# EAGLE design main (EAGLE 6.4)
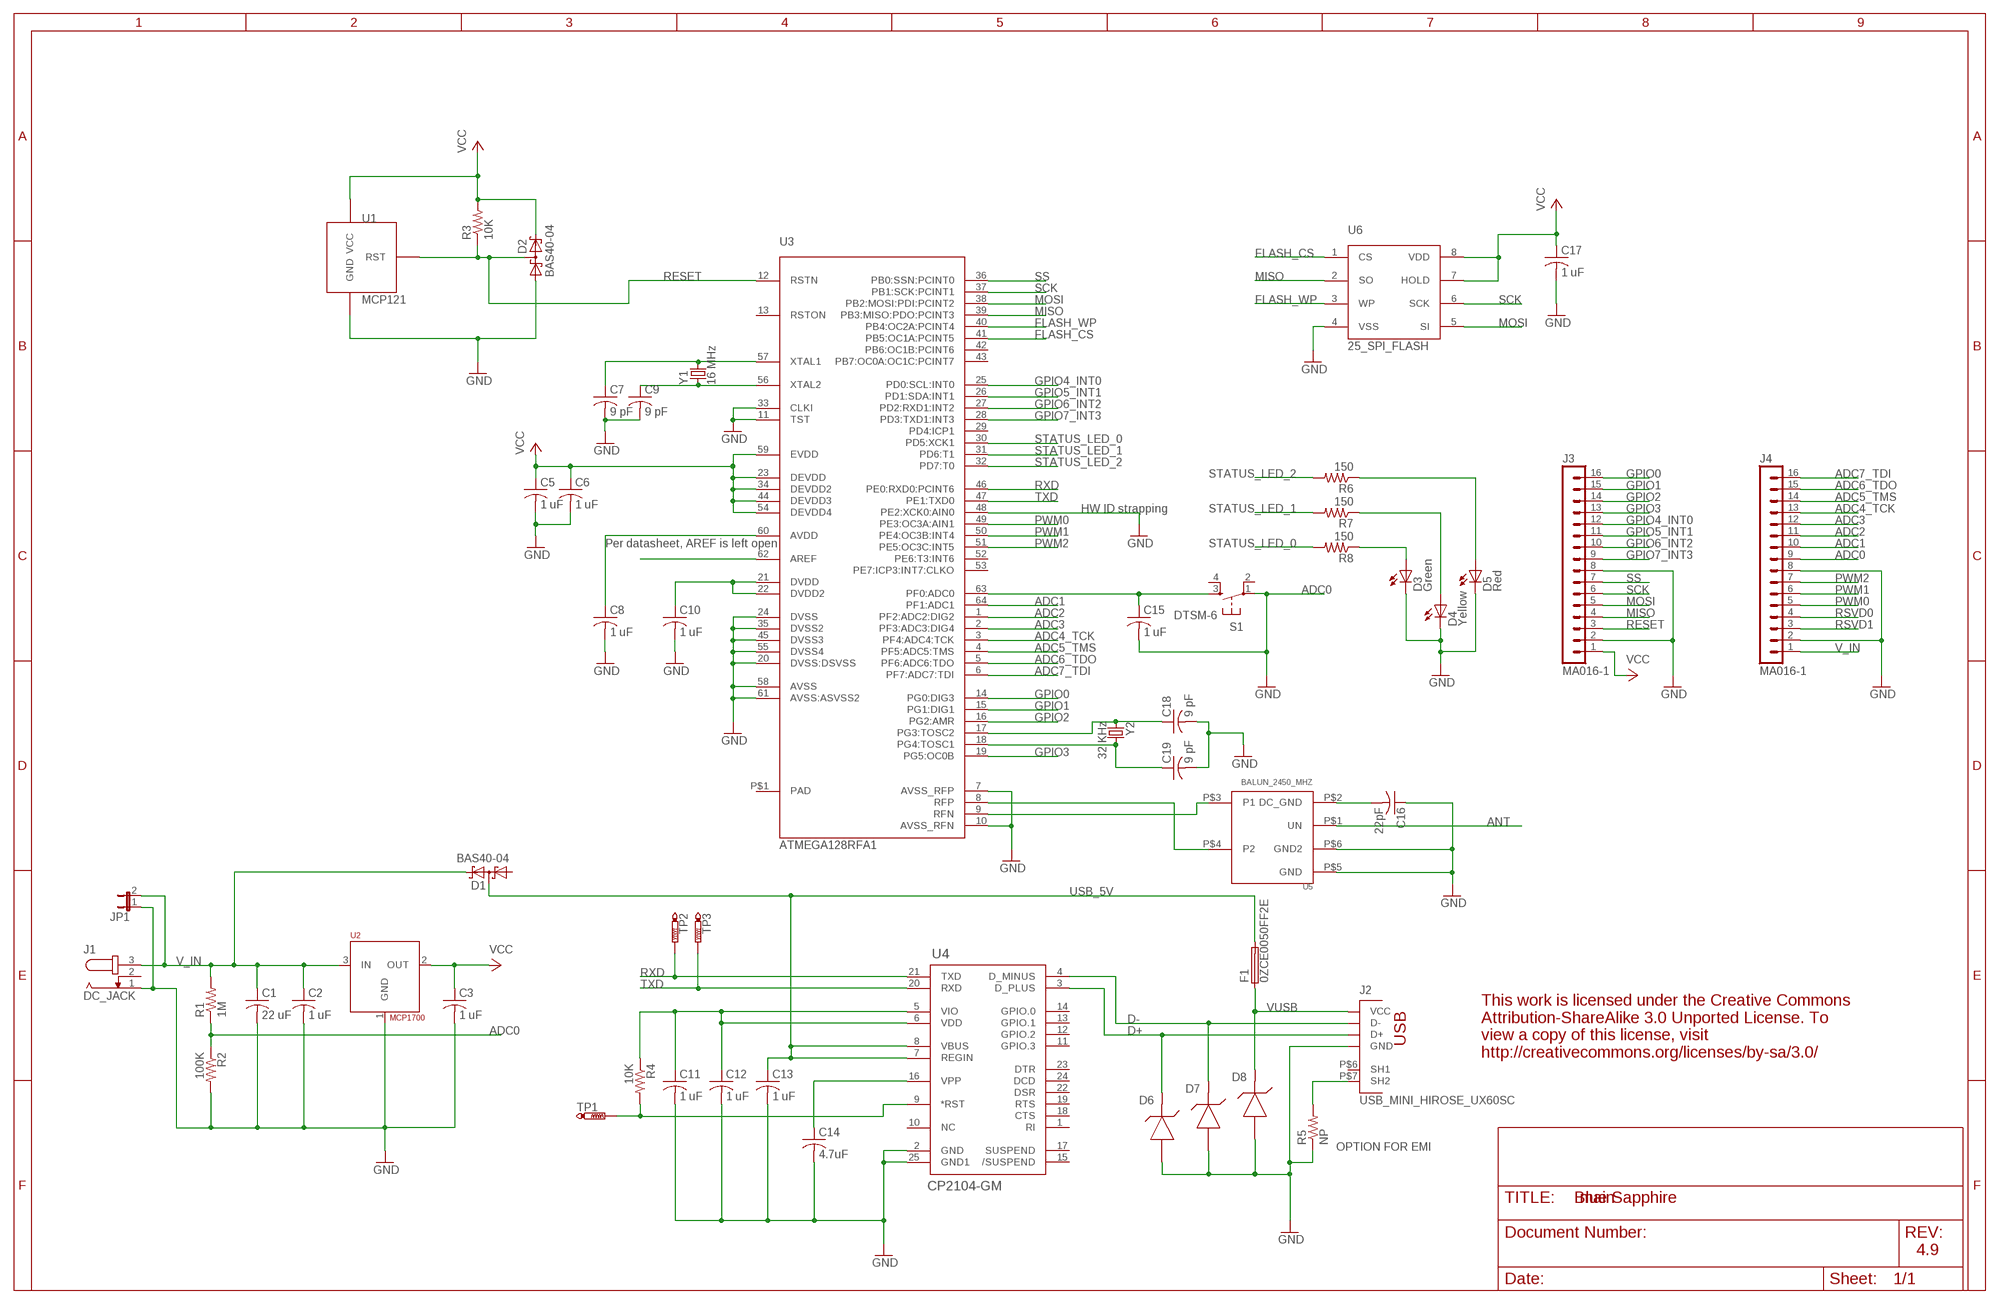
[diagram p0: schematic, sheet 1]

## Parts
C1  22 uF  C-USC0805K  [C0805K]
C2  1 uF  C-USC0603K  [C0603K]
C3  1 uF  C-USC0603K  [C0603K]
C5  1 uF  C-USC0603K  [C0603K]
C6  1 uF  C-USC0603K  [C0603K]
C7  9 pF  C-USC0603K  [C0603K]
C8  1 uF  C-USC0603K  [C0603K]
C9  9 pF  C-USC0603K  [C0603K]
C10  1 uF  C-USC0603K  [C0603K]
C11  1 uF  C-USC0603K  [C0603K]
C12  1 uF  C-USC0603K  [C0603K]
C13  1 uF  C-USC0603K  [C0603K]
C14  4.7uF  C-USC0805K  [C0805K]
C15  1 uF  C-USC0603K  [C0603K]
C16  22pF  C-USC0603K  [C0603K]
C17  1 uF  C-USC0603K  [C0603K]
C18  9 pF  C-USC0603K  [C0603K]
C19  9 pF  C-USC0603K  [C0603K]
D1  BAS40-04  [SOT23]
D2  BAS40-04  [SOT23]
D3  Green  LEDCHIPLED_0805  [CHIPLED_0805]
D4  Yellow  LEDCHIPLED_0805  [CHIPLED_0805]
D5  Red  LEDCHIPLED_0805  [CHIPLED_0805]
D6  CG0603MLC  [C0603]
D7  CG0603MLC  [C0603]
D8  CG0603MLC  [C0603]
F1  0ZCE0050FF2E  [C0805]
J1  DC_JACK  [CONN_DC_JACK]
J2  USB_MINI_HIROSE_UX60SC  [USB-MINI-B_HIROSE_UX60SC]
J3  MA016-1  [MA016-1]
J4  MA016-1  [MA016-1]
JP1  JP1E  [JP1]
R1  1M  R-US_R0603  [R0603]
R2  100K  R-US_R0603  [R0603]
R3  10K  R-US_R0603  [R0603]
R4  10K  R-US_R0603  [R0603]
R5  NP  R-US_R0603  [R0603]
R6  150  R-US_R0603  [R0603]
R7  150  R-US_R0603  [R0603]
R8  150  R-US_R0603  [R0603]
S1  DTSM-6  [DTSM-6]
TP1  PTR1B1,27  [B1,27]
TP2  PTR1B1,27  [B1,27]
TP3  PTR1B1,27  [B1,27]
U1  MCP121  [SOT23]
U2  MCP1700  [SOT23]
U3  ATMEGA128RFA1  [MLF64]
U4  CP2104-GM  [QFN24_4X4]
U5  BALUN_2450_MHZ  [BALUN_0805]
U6  25_SPI_FLASH  [SO-8WIDE]
Y1  16 MHz  CRYSTAL_3.2X2.5  [XTAL_3.2X2.5]
Y2  32 KHz  CRYSTAL_3.2X1.5  [XTAL_3.2X1.5]

## Nets
ADC0: C15.1 J4.9 R1.1 R2.1 S1.3 U3.63(PF0:ADC0)
ADC1: J4.10 U3.64(PF1:ADC1)
ADC2: J4.11 U3.1(PF2:ADC2:DIG2)
ADC3: J4.12 U3.2(PF3:ADC3:DIG4)
ADC4_TCK: J4.13 U3.3(PF4:ADC4:TCK)
ADC5_TMS: J4.14 U3.4(PF5:ADC5:TMS)
ADC6_TDO: J4.15 U3.5(PF6:ADC6:TDO)
ADC7_TDI: J4.16 U3.6(PF7:ADC7:TDI)
ANT: U5.P$1(UN)
AREF: U3.62(AREF)
AVDD: C8.1 U3.60(AVDD)
D+: D6.2(LINE) J2.P$3(D+) U4.3(D_PLUS)
D-: D7.2(LINE) J2.P$2(D-) U4.4(D_MINUS)
DVDD: C10.1 U3.21(DVDD) U3.22(DVDD2)
FLASH_CS: U3.41(PB5:OC1A:PCINT5) U6.1(CS)
FLASH_WP: U3.40(PB4:OC2A:PCINT4) U6.3(WP)
GND: C1.2 C2.2 C3.2 C5.2 C6.2 C7.2 C8.2 C9.2 C10.2 C11.2 C12.2 C13.2 C14.2 C15.2 C16.1 C17.2 C18.2 C19.2 D2.1(A1) D3.C D4.C D5.C D6.1(GND) D7.1(GND) D8.1(GND) J1.1 J2.P$5(GND) J3.2 J3.8 J4.2 J4.8 JP1.1 R2.2 R5.1 S1.1 U1.3(GND) U2.1(GND) U3.7(AVSS_RFP) U3.10(AVSS_RFN) U3.11(TST) U3.20(DVSS:DSVSS) U3.24(DVSS) U3.33(CLKI) U3.35(DVSS2) U3.45(DVSS3) U3.48(PE2:XCK0:AIN0) U3.55(DVSS4) U3.58(AVSS) U3.61(AVSS:ASVSS2) U4.2(GND) U4.25(GND1) U5.P$5(GND) U5.P$6(GND2) U6.4(VSS)
GPIO0: J3.16 U3.14(PG0:DIG3)
GPIO1: J3.15 U3.15(PG1:DIG1)
GPIO2: J3.14 U3.16(PG2:AMR)
GPIO3: J3.13 U3.19(PG5:OC0B)
GPIO4_INT0: J3.12 U3.25(PD0:SCL:INT0)
GPIO5_INT1: J3.11 U3.26(PD1:SDA:INT1)
GPIO6_INT2: J3.10 U3.27(PD2:RXD1:INT2)
GPIO7_INT3: J3.9 U3.28(PD3:TXD1:INT3)
MISO: J3.4 U3.39(PB3:MISO:PDO:PCINT3) U6.2(SO)
MOSI: J3.5 U3.38(PB2:MOSI:PDI:PCINT2) U6.5(SI)
N$1: C16.2 U5.P$2(DC_GND)
N$2: C19.1 U3.18(PG4:TOSC1) Y2.P$2
N$3: U3.8(RFP) U5.P$4(P2)
N$4: R4.2 TP1.TP U4.9(*RST)
N$6: D3.A R8.1
N$7: J2.P$7(SH2) R5.2
N$8: D4.A R7.1
N$9: D5.A R6.1
N$10: U3.9(RFN) U5.P$3(P1)
N$12: C18.1 U3.17(PG3:TOSC2) Y2.P$1
N$24: C14.1 U4.16(VPP)
PWM0: J4.5 U3.49(PE3:OC3A:AIN1)
PWM1: J4.6 U3.50(PE4:OC3B:INT4)
PWM2: J4.7 U3.51(PE5:OC3C:INT5)
RESET: D2.3(C1A2) J3.3 R3.1 U1.1(RST) U3.12(RSTN)
RSVD0: J4.4
RSVD1: J4.3
RXD: TP2.TP U3.46(PE0:RXD0:PCINT6) U4.21(TXD)
SCK: J3.6 U3.37(PB1:SCK:PCINT1) U6.6(SCK)
SS: J3.7 U3.36(PB0:SSN:PCINT0)
STATUS_LED_0: R8.2 U3.30(PD5:XCK1)
STATUS_LED_1: R7.2 U3.31(PD6:T1)
STATUS_LED_2: R6.2 U3.32(PD7:T0)
TXD: TP3.TP U3.47(PE1:TXD0) U4.20(RXD)
USB_5V: C13.1 D1.3(C1A2) F1.2 U4.7(REGIN) U4.8(VBUS)
USB_VDD: C11.1 C12.1 R4.1 U4.5(VIO) U4.6(VDD)
V_IN: C1.1 C2.1 D1.2(C2) J1.3 J4.1 JP1.2 R1.2 U2.3(IN)
VCC: C3.1 C5.1 C6.1 C17.1 D2.2(C2) J3.1 R3.2 U1.2(VCC) U2.2(OUT) U3.23(DEVDD) U3.34(DEVDD2) U3.44(DEVDD3) U3.54(DEVDD4) U3.59(EVDD) U6.7(HOLD) U6.8(VDD)
VUSB: D8.2(LINE) F1.1 J2.P$1(VCC)
XTAL1: C7.1 U3.57(XTAL1) Y1.P$3
XTAL2: C9.1 U3.56(XTAL2) Y1.P$1
Unconnected: D1.1(A1) J1.2 J2.P$6(SH1) S1.2 S1.4 U3.13(RSTON) U3.29(PD4:ICP1) U3.42(PB6:OC1B:PCINT6) U3.43(PB7:OC0A:OC1C:PCINT7) U3.52(PE6:T3:INT6) U3.53(PE7:ICP3:INT7:CLKO) U3.P$1(PAD) U4.1(RI) U4.10(NC) U4.11(GPIO.3) U4.12(GPIO.2) U4.13(GPIO.1) U4.14(GPIO.0) U4.15(/SUSPEND) U4.17(SUSPEND) U4.18(CTS) U4.19(RTS) U4.22(DSR) U4.23(DTR) U4.24(DCD)

## Notes on the sheet
- HW ID strapping
- Per datasheet, AREF is left open
- This work is licensed under the Creative Commons 
  Attribution-ShareAlike 3.0 Unported License. To 
  view a copy of this license, visit 
  http://creativecommons.org/licenses/by-sa/3.0/
- OPTION FOR EMI
- Blue Sapphire
- 4.9

## Library data of the parts
C1-C3 C5-C19 = rcl:C-US: CAPACITOR, American symbol
D1 D2 = diode:BAS40-04: Silicon Schottky Diodes General-purpose diode for high-speed switching
D3-D5 = led:LED: LED OSRAM: - CHIPLED LG R971, LG N971, LY N971, LG Q971, LY Q971, LO R971, LY R971 LH N974, LH R974 LS Q976, LO Q976, LY Q976 LO Q996 - Hyper CHIPLED LW Q18S LB Q993, LB Q99A, LB R99A - SideLED LS A670, LO A670, LY A670, LG A670, LP A670 LB A673, LV A673, LT A673, LW A673 LH A674 LY A675 LS A676, LA A676, LO A676, LY A676, LW A676 LS A679, LY A679, LG A679 - Hyper Micro SIDELED® LS Y876, LA Y876, LO Y876, LY Y876 LT Y87S - SmartLED LW L88C, LW L88S LB L89C, LB L89S, LG L890 LS L89K, LO L89K, LY L89K LS L896, LA L896, LO L896, LY L896 - TOPLED LS T670, LO T670, LY T670, LG T670, LP T670 LSG T670, LSP T670, LSY T670, LOP T670, LYG T670 LG T671, LOG T671, LSG T671 LB T673, LV T673, LT T673, LW T673 LH T674 LS T676, LA T676, LO T676, LY T676, LB T676, LH T676, LSB T676, LW T676 LB T67C, LV T67C, LT T67C, LS T67K, LO T67K, LY T67K, LW E67C LS E67B, LA E67B, LO E67B, LY E67B, LB E67C, LV E67C, LT E67C LW T67C LS T679, LY T679, LG T679 LS T770, LO T770, LY T770, LG T770, LP T770 LB T773, LV T773, LT T773, LW T773 LH T774 LS E675, LA E675, LY E675, LS T675 LS T776, LA T776, LO T776, LY T776, LB T776 LHGB T686 LT T68C, LB T68C - Hyper Mini TOPLED® LB M676 - Mini TOPLED Santana® LG M470 LS M47K, LO M47K, LY M47K Source: http://www.osram.convergy.de LUXEON: - LUMILED® LXK2-PW12-R00, LXK2-PW12-S00, LXK2-PW14-U00, LXK2-PW14-V00 LXK2-PM12-R00, LXK2-PM12-S00, LXK2-PM14-U00 LXK2-PE12-Q00, LXK2-PE12-R00, LXK2-PE12-S00, LXK2-PE14-T00, LXK2-PE14-U00 LXK2-PB12-K00, LXK2-PB12-L00, LXK2-PB12-M00, LXK2-PB14-N00, LXK2-PB14-P00, LXK2-PB14-Q00 LXK2-PR12-L00, LXK2-PR12-M00, LXK2-PR14-Q00, LXK2-PR14-R00 LXK2-PD12-Q00, LXK2-PD12-R00, LXK2-PD12-S00 LXK2-PH12-R00, LXK2-PH12-S00 LXK2-PL12-P00, LXK2-PL12-Q00, LXK2-PL12-R00 Source: www.luxeon.com KINGBRIGHT: KA-3528ASYC Source: www.kingbright.com
D6-D8 = sapphire:CG0603MLC: ESD Suppressor, 5VDC DigiKey: CG0603MLC-05ECT-ND
F1 = sapphire:0ZCE0050FF2E
J1 = sapphire:DC_JACK
J2 = sapphire:USB_MINI_HIROSE_UX60SC
J3 J4 = sapphire:MA016-1
JP1 = jumper:JP1E: JUMPER
R1-R8 = rcl:R-US_: RESISTOR, American symbol
S1 = sapphire:DTSM-6
TP1-TP3 = testpad:PTR1: TEST PIN
U1 = sapphire:MCP121
U2 = sapphire:MCP1700: MCP1700 Linear Voltage Regulator
U3 = sapphire:ATMEGA128RFA1
U4 = sapphire:CP2104-GM
U5 = sapphire:BALUN_2450_MHZ
U6 = sapphire:25_SPI_FLASH: Atmel AT25 series SPI dataflash / Microchip SST25 series SPI flash
Y1 = sapphire:CRYSTAL_3.2X2.5
Y2 = sapphire:CRYSTAL_3.2X1.5

## Net classes
0 default: clearance 0.203 mm

## Board
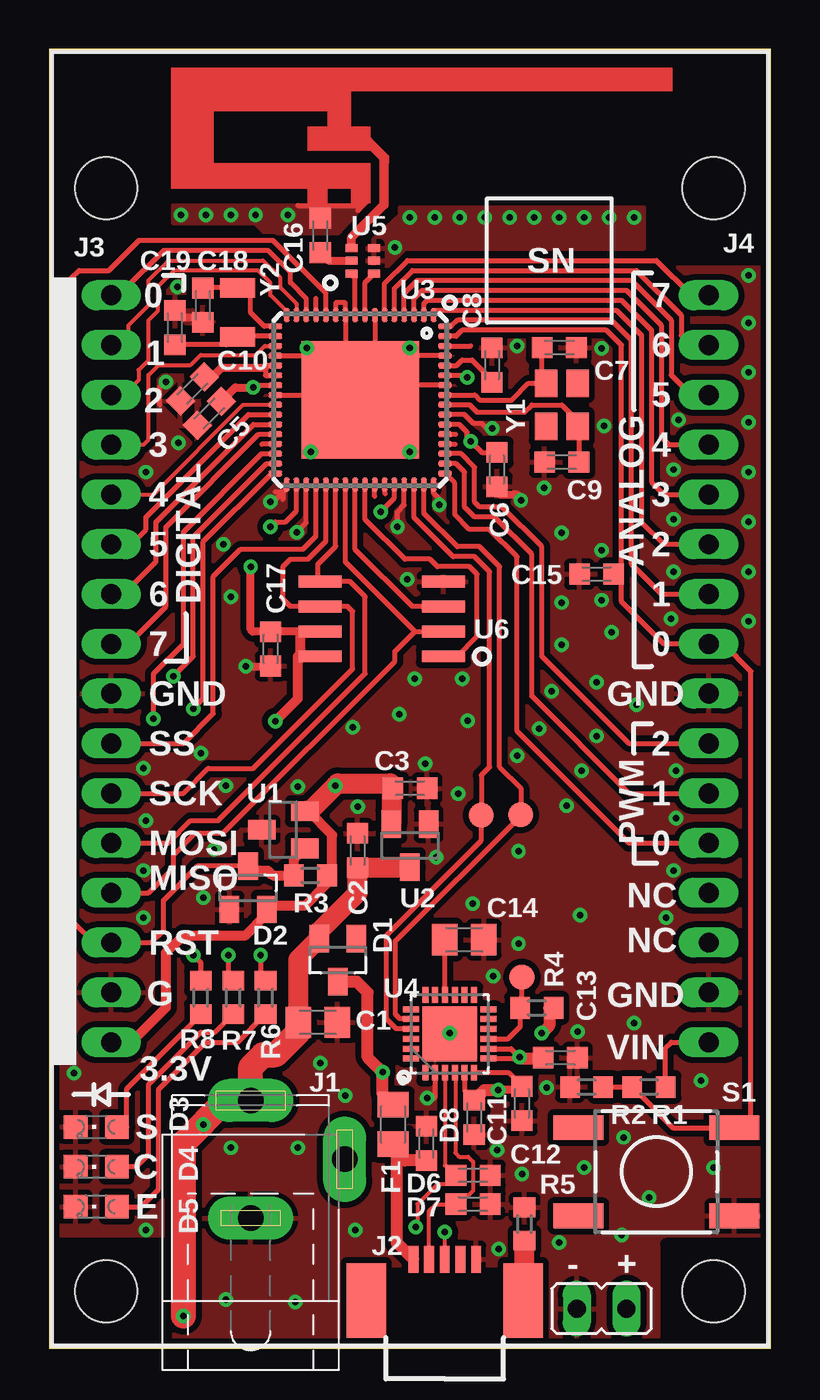
[diagram p1: board, top side]
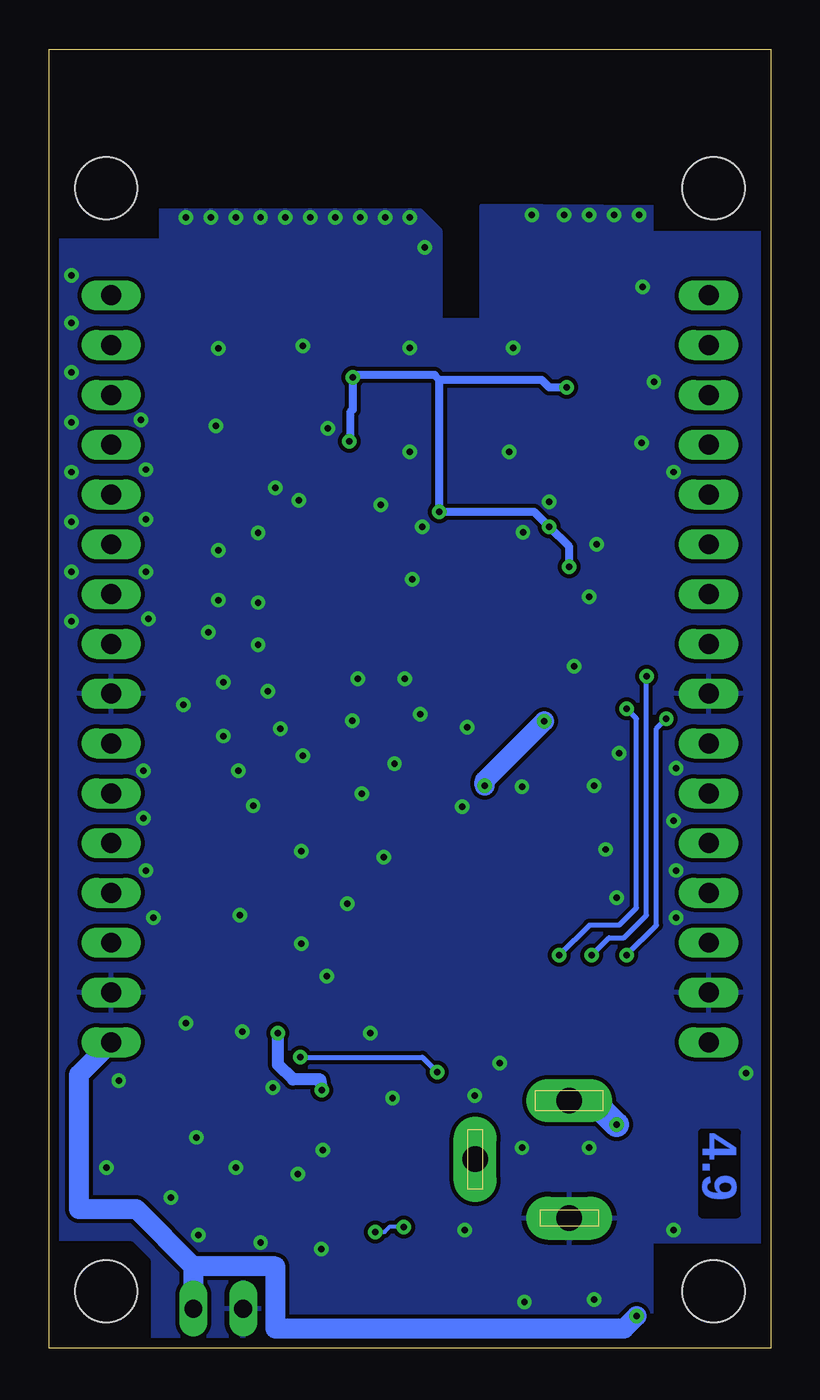
[diagram p2: board, bottom side, seen from below]

Size 36.83 x 66.28 mm. Coordinates in mm from the lower left corner, seen from the top.
Outline: 0,0 36.83,0 36.83,66.28 0,66.28 0,0
Copper layers (1*16): Top 0.035mm / dielectric 1.5mm / Bottom 0.035mm
Design rules "sapphire *": minimum track width 8mil, minimum drill 13mil, track to track 8mil, track to pad 8mil, pad to pad 8mil, via to via 8mil, smd to smd 8mil, copper to edge 20mil, drill to drill 8mil, minimum pad ring 10mil, minimum via ring 8mil, stop-mask expansion 4mil, vias tented up to drill 0mil, thermal gap 10mil
Holes 3.17 mm at 2.92,2.92 33.91,2.92 2.92,59.18 33.91,59.18
tRestrict: area 31.5,0.5 to 36.3,5.3; area 0.5,0.5 to 6,5.3; area 17.4,0.6 to 23.1,3.8; area 8.9,52.3 to 9.9,53.2
bRestrict: area 0.3,57 to 6,61.5; area 31.2,56.6 to 36.6,60.7; area 0.5,0.5 to 6,5.3; area 31.8,0.5 to 36.3,5.3

### Footprints (pad centres in the part's own frame; a part is rotated, then mirrored left to right if it is on the bottom)
C0805K = smd 1.3 x 1.6: 1 -1,0; 2 1,0
C0603K = smd 1.05 x 1.08: 1 -0.875,0; 2 0.875,0
SOT23 = smd 1 x 1.4: 1 -0.95,-1.1; 2 0.95,-1.1; 3 0,1.1
CHIPLED_0805 = smd 1.2 x 1.2: A 0,-1.05; C 0,1.05
C0603 = smd 1.05 x 1.08: 1 -0.875,0; 2 0.875,0
C0805 = smd 1.3 x 1.6: 1 -1,0; 2 1,0
CONN_DC_JACK = drill 1.3 pad 2.184 long: 1 -3,0; 2 0,-4.8; 3 3,0
USB-MINI-B_HIROSE_UX60SC = smd 0.5 x 1.4: P$1 -1.6,6.1; P$2 -0.8,6.1; P$3 0,6.1; P$4 0.8,6.1; P$5 1.6,6.1 | smd 2 x 3.8: P$6 -4,4; P$7 4,4
MA016-1 = drill 1.016 long: 1 -19.05,0; 2 -16.51,0; 3 -13.97,0; 4 -11.43,0; 5 -8.89,0; 6 -6.35,0; 7 -3.81,0; 8 -1.27,0; 9 1.27,0; 10 3.81,0; 11 6.35,0; 12 8.89,0; 13 11.43,0; 14 13.97,0; 15 16.51,0; 16 19.05,0
JP1 = drill 0.914 long: 1 0,-1.27; 2 0,1.27
R0603 = smd 1 x 1.1: 1 -0.85,0; 2 0.85,0
DTSM-6 = smd 2.54 x 1.27: 1 -3.975,2.25; 2 3.975,2.25; 3 -3.975,-2.25; 4 3.975,-2.25
B1,27 = smd 1.27 x 1.27: TP 0,0
MLF64 = smd 0.7 x 0.3: 1 -4.325,3.75; 2 -4.325,3.25; 3 -4.325,2.75; 4 -4.325,2.25; 5 -4.325,1.75; 6 -4.325,1.25; 7 -4.325,0.75; 8 -4.325,0.25; 9 -4.325,-0.25; 10 -4.325,-0.75; 11 -4.325,-1.25; 12 -4.325,-1.75; 13 -4.325,-2.25; 14 -4.325,-2.75; 15 -4.325,-3.25; 16 -4.325,-3.75; 33 4.325,-3.75; 34 4.325,-3.25; 35 4.325,-2.75; 36 4.325,-2.25; 37 4.325,-1.75; 38 4.325,-1.25; 39 4.325,-0.75; 40 4.325,-0.25; 41 4.325,0.25; 42 4.325,0.75; 43 4.325,1.25; 44 4.325,1.75; 45 4.325,2.25; 46 4.325,2.75; 47 4.325,3.25; 48 4.325,3.75 | smd 0.3 x 0.7: 17 -3.75,-4.325; 18 -3.25,-4.325; 19 -2.75,-4.325; 20 -2.25,-4.325; 21 -1.75,-4.325; 22 -1.25,-4.325; 23 -0.75,-4.325; 24 -0.25,-4.325; 25 0.25,-4.325; 26 0.75,-4.325; 27 1.25,-4.325; 28 1.75,-4.325; 29 2.25,-4.325; 30 2.75,-4.325; 31 3.25,-4.325; 32 3.75,-4.325; 49 3.75,4.325; 50 3.25,4.325; 51 2.75,4.325; 52 2.25,4.325; 53 1.75,4.325; 54 1.25,4.325; 55 0.75,4.325; 56 0.25,4.325; 57 -0.25,4.325; 58 -0.75,4.325; 59 -1.25,4.325; 60 -1.75,4.325; 61 -2.25,4.325; 62 -2.75,4.325; 63 -3.25,4.325; 64 -3.75,4.325 | smd 6 x 6: P$1 0,0
QFN24_4X4 = smd 0.813 x 0.305: 1 -1.98,1.245; 2 -1.98,0.762; 3 -1.98,0.254; 4 -1.98,-0.254; 5 -1.98,-0.762; 6 -1.98,-1.245; 13 1.98,-1.245; 14 1.98,-0.762; 15 1.98,-0.254; 16 1.98,0.254; 17 1.98,0.762; 18 1.98,1.245 | smd 0.305 x 0.813: 7 -1.245,-1.98; 8 -0.762,-1.98; 9 -0.254,-1.98; 10 0.254,-1.98; 11 0.762,-1.98; 12 1.245,-1.98; 19 1.245,1.98; 20 0.762,1.98; 21 0.254,1.98; 22 -0.254,1.98; 23 -0.762,1.98; 24 -1.245,1.98 | smd 2.794 x 2.794: 25 0,0
BALUN_0805 = smd 0.4 x 0.6: P$1 1.65,1.2; P$2 1,1.2; P$3 0.35,1.2; P$4 0.35,0.05; P$5 1,0.05; P$6 1.65,0.05
SO-8WIDE = smd 0.6 x 2.2: 1 -1.905,-2.6; 2 -0.635,-2.6; 3 0.635,-2.6; 4 1.905,-2.6; 5 1.905,3.7; 6 0.635,3.7; 7 -0.635,3.7; 8 -1.905,3.7
XTAL_3.2X2.5 = smd 1.4 x 1.15: P$1 -1.1,-0.8; P$2 1.1,-0.8; P$3 1.1,0.8; P$4 -1.1,0.8
XTAL_3.2X1.5 = smd 1 x 1.8: P$1 -1.2,0; P$2 1.3,0

### Placement (x,y rotation side)
ANT  [F_ANTENNA_2_4GHZ]  6.22,58.42 0 top
C1  13.72,16.64 0 top
C2  15.75,25.4 90 top
C3  18.41,28.57 0 top
C5  8.18,47.7 225 top
C6  22.86,44.83 270 top
C7  26.04,51.05 0 top
C8  22.61,50.16 90 top
C9  26.16,45.21 180 top
C10  7.32,48.95 225 top
C11  21.69,11.79 270 top
C12  24.13,12.5 270 top
C13  26.09,14.83 0 top
C14  21.18,20.85 0 top
C15  27.94,39.5 180 top
C16  13.84,56.77 270 top
C17  11.3,35.69 270 top
C18  7.85,53.21 270 top
C19  6.43,52.07 90 top
D1  14.73,19.81 180 top
D2  10.16,23.5 0 top
D3  2.41,11.3 90 top
D4  2.41,9.27 90 top
D5  2.41,7.24 90 top
D6  21.64,8.84 180 top
D7  21.64,7.37 180 top
D8  19.25,10.46 270 top
F1  17.55,11.43 90 top
J1  10.29,9.65 90 top
J2  20.19,-1.55 0 top
J3  3.17,34.67 90 top
J4  33.66,34.67 90 top
JP1  28.19,2.03 270 top
R1  30.61,13.34 0 top
R2  27.43,13.34 180 top
R3  13.34,24.13 0 top
R4  24.89,17.37 180 top
R5  24.26,6.35 270 top
R6  11.05,17.91 90 top
R7  9.4,17.91 90 top
R8  7.75,17.91 90 top
S1  30.99,9.02 180 top
TP1  24.13,18.95 0 top
TP2  22.06,27.19 0 top
TP3  24.07,27.22 0 top
U1  11.95,26.46 90 top
U2  18.41,25.65 180 top
U3  15.88,48.39 270 top
U4  20.45,16.05 90 top
U5  16.64,54.48 90 top
U6  17.53,37.21 90 top
Y1  26.16,48.13 90 top
Y2  9.63,52.91 270 top

### Tracks (layer width: path | path; a pad name or v marks a point on that pad's centre or on a via)
ADC0
  Top 0.254: 29.21,39.5 29.21,38.1 31.37,35.94 J4.9 34.42,35.94 35.81,34.54 35.81,11.43 35.69,11.3 35,11.3 S1.3 31.82,11.27 R1.1 R2.1 | 29.21,39.5 29.21,51.18 28.45,51.94 21.08,51.94 20.78,51.64 U3.63 | 29.21,39.5 C15.1
ADC1
  Top 0.254: U3.64 20.51,52.14 20.83,52.45 28.7,52.45 29.72,51.44 29.72,40.01 31.24,38.48 J4.10
ADC2
  Top 0.254: U3.1 19.62,52.9 19.68,52.96 28.96,52.96 30.23,51.69 30.23,42.16 31.37,41.02 J4.11
ADC3
  Top 0.254: U3.2 19.12,53.29 19.3,53.47 29.21,53.47 30.73,51.94 30.73,44.2 31.37,43.56 J4.12
ADC4_TCK
  Top 0.254: U3.3 18.62,53.55 19.05,53.98 29.46,53.98 31.24,52.2 31.24,46.48 31.62,46.1 J4.13
ADC5_TMS
  Top 0.254: U3.4 18.12,53.81 18.8,54.48 29.72,54.48 31.75,52.45 31.75,49.66 32.77,48.64 J4.14
ADC6_TDO
  Top 0.254: U3.5 17.62,54.07 18.54,54.99 29.97,54.99 32.26,52.7 32.26,51.69 32.77,51.18 J4.15
ADC7_TDI
  Top 0.254: U3.6 17.12,54.34 18.29,55.5 30.99,55.5 32.77,53.72 J4.16
AREF
  Top 0.254: U3.62 21.52,51.14
AVDD
  Top 0.254: U3.60 20.8,50.14 21.08,50.42 21.59,50.42 22.23,49.78 22.23,49.67 C8.1
D+  (via drill 0.33)
  Top 0.203: U4.3 20.19,9.34 D6.2 20.39,8.38 19.81,8.38 18.8,7.37 18.8,6.25 v18.72,6.2 | J2.P$3 v20.19,5.94
  Bottom 0.203: v20.19,5.94 19.71,5.94 19.43,6.22 18.77,6.22 v18.72,6.2
D-
  Top 0.203: 20.73,14.05 20.73,9.98 20.93,9.78 21.39,9.78 21.64,9.53 21.64,8.05 21.41,7.82 21.13,7.82 20.77,7.46 | J2.P$2 19.39,7.02 19.74,7.37 D7.2
  Top 0.254: U4.4 20.73,14.05 | 20.98,7.42 D7.2 20.77,7.46
DVDD
  Top 0.254: U3.22 11.05,49.64 11.05,50.04 11.15,50.14 U3.21
  Top 0.406: 11.05,50.04 8.81,50.04 8.34,49.56 C10.1
FLASH_CS
  Top 0.254: U3.41 16.13,42.29 18.16,40.26 19.43,40.26 19.81,39.88 21.46,39.88 21.84,39.5 21.84,36.32 20.83,35.31 U6.1
FLASH_WP
  Top 0.254: U3.40 15.62,40.76 18.54,37.85 U6.3
GND  (via drill 0.33)
  Top 0.254: 15.12,51.17 U3.10 15.12,53.2 15.11,53.34 14.63,53.34 U3.11 | 15.12,51.17 15.24,51.05 16.64,51.05 | U3.7 16.62,51.32 16.64,51.31 16.64,51.05 | 18.45,50.64 18.41,50.67 v18.41,51.03 | U3.35 13.12,42.11 v12.65,41.63 | U3.45 18.12,43.02 17.78,42.67 v17.78,41.91 | U3.33 12.12,43.88 11.94,43.69 | 11.94,43.69 11.43,43.18 v11.3,43.18 | U3.48 19.62,43.62 19.87,43.37 19.94,43.05 | 11.94,43.69 11.94,43.31 | 11.94,43.69 11.56,43.69 | 16,58.29 15.75,58.04 | 16,58.29 16.26,58.55 | 12.7,58.29 16,58.29 | 22.55,46.99 v22.61,46.94 22.33,46.94 22.07,47.19 21.64,47.19 21.2,47.64 U3.55 | U4.2 19.68,12.78 v19.3,12.78 | v18.41,51.03 16.64,51.03 16.64,51.05 | 20.19,49.12 U3.58 18.41,49.14 v18.41,51.03 | U3.61 18.41,50.64 v18.41,51.03 | U3.20 13.59,50.64 | 13.59,50.64 15.12,50.64 15.12,51.17 | U3.24 13.59,48.64 13.59,50.64 | 5.65,48.13 5.65,49.05 5.95,49.34 5.95,49.32 v5.96,49.3 v5.97,49.3
  Top 0.406: C6.2 22.73,43.83 22.73,43.81 22.99,43.56 23.7,43.56 arc-90 v24.08,43.26 | C17.2 11.42,34.8 v10.03,34.8 | C18.2 7.75,52.58 6.84,52.58 C19.2
  other vias: 13.15,51.03 18.41,45.74 13.35,45.74 6.6,46.2 4.83,29.59 7.75,30.35 4.95,26.92 4.83,24.38 9.02,28.7 7.87,22.99 4.83,21.97 18.29,39.24 8.89,41.02 9.27,38.35 23.88,30.23 25.02,31.62 25.65,33.53 26.42,27.69 27.18,29.46 27.94,31.24 32,29.46 32,27.05 31.88,24.38 31.5,21.97 18.67,34.16 21.08,34.16 4.95,44.7 35.69,54.74 35.69,52.32 35.69,49.78 35.69,47.24 35.69,44.7 35.69,42.16 35.69,39.62 35.69,37.08 26.16,41.61 26.16,38.05 26.16,35.89 27.94,33.99 29.97,32.84 28.7,36.53 28.19,38.18 28.19,40.72 31.88,42.29 31.88,44.83 31.88,39.62 31.75,37.21 32.13,47.37 19.91,43.03 6.73,57.81 8,57.81 9.27,57.81 10.54,57.81 12.19,57.81 18.41,57.68 19.68,57.68 20.95,57.68 22.23,57.68 23.5,57.68 24.77,57.68 26.04,57.68 27.3,57.68 28.57,57.68 29.84,57.68 17.65,56.16 28.19,51 23.88,51.13 29.84,16.59 25.4,13.31 33.27,13.67 9.02,2.49 12.57,2.36 15.62,6.05 9.27,10.24 13.84,14.55 12.7,10.24 4.95,6.05 15.11,12.9 28.32,47.07 15.75,27.64 19.76,25.07 12.7,28.65 8.43,25.46 15.49,31.7 21.36,32.03 17.88,32.36 26.04,5.41 29.21,5.79 22.94,5.08 33.91,9.22 27.3,9.22 30.61,7.7 29.31,10.77 1.27,14.05 20.45,16.08 21.62,22.68 23.95,20.65 23.95,25.37 22.66,19 19.2,29.82 20.88,28.3 27.1,22.1 24.13,8.89 6.55,54.15 25.27,43.89 26.97,16.15 22.86,10.11
  pour Bottom (rank 4): -1.91,55.5 -8.89,-7.75 48.74,-10.66 49.99,58.09 17.91,58.04 16.89,57.02 16.89,52.45 14.73,52.45 14.73,58.29 -0.76,58.17 -2.29,57.28
  pour Top (isolate 0.305, rank 4): -2.16,54.86 -5.33,-4.19 53.61,-7.32 54.13,55.12 20.07,55.12 20.07,44.07 11.68,44.07 11.68,56.52 -0.38,56.64 -0.25,55.24 -0.13,55.24
  pour Top: 16.26,55.24 17.27,55.24 18.16,56.13 30.35,56.13 30.35,58.17 17.91,58.17 17.91,57.78 16.26,56.26
  pour Top (no thermals): 6.35,58.29 16,58.29 14.73,56.9 11.05,56.9 10.54,57.4 6.35,57.4
GPIO0
  Top 0.254: U3.14 13.12,53.55 12.32,54.36 12.32,54.86 11.18,56.01 5.84,56.01 3.81,53.98 3.43,53.98 J3.16
GPIO1
  Top 0.203: U3.15 12.62,53.29 11.81,54.1 11.81,54.61 10.92,55.5 6.1,55.5 5.08,54.48 5.08,53.21 4.06,52.2 4.06,51.56 3.68,51.18 J3.15
GPIO2
  Top 0.203: 12.06,52.77 12.06,52.96 11.3,53.72 11.3,54.36 10.67,54.99 6.38,54.99 5.54,54.15 5.54,52.91 5.08,52.45 5.08,50.42 4.57,49.91 4.57,49.38 3.83,48.64 J3.14
  Top 0.254: 12.06,52.77 U3.16 | J3.14
GPIO3
  Top 0.203: J3.13 4.83,46.1 5.08,46.35 5.08,49.66 5.59,50.16 7.24,50.16 7.75,50.67 10.54,50.67 11.01,51.14 U3.19
GPIO4_INT0
  Top 0.203: U3.25 9.91,48.14 5.33,43.56 J3.12
GPIO5_INT1
  Top 0.254: U3.26 10.17,47.64 4.95,42.42 4.95,41.78 4.19,41.02 J3.11
GPIO6_INT2
  Top 0.254: U3.27 10.43,47.14 5.46,42.16 5.46,40.13 3.81,38.48 J3.10
GPIO7_INT3
  Top 0.254: U3.28 10.7,46.64 5.97,41.91 5.97,37.85 4.06,35.94 J3.9
MISO
  Top 0.254: U3.39 15.12,40.12 18.67,36.58 | 18.67,36.58 U6.2 | 18.67,36.58 17.65,35.56 17.65,35.05 8.89,26.29 7.49,26.29 6.35,25.15 6.35,24.51 5.08,23.24 J3.4
MOSI
  Top 0.254: U3.38 14.62,40.91 13.72,40.01 13.72,39.37 13.84,39.24 13.84,39.12 | 13.84,39.12 15.37,39.12 16.13,38.35 16.13,34.42 8.64,26.92 7.24,26.92 6.1,25.78 J3.5 | U6.5 13.84,39.12
N$1
  Top 0.406: U5.P$2 14.31,55.48 C16.2
N$2
  Top 0.254: U3.18 9.5,51.64 Y2.P$2 9.06,51.2 C19.1
N$3
  Top 0.254: U3.8 16.12,54.37 U5.P$4
N$4
  Top 0.254: U4.9 23.42,15.8 24.04,16.42 R4.2 24.13,17.46 TP1.TP
N$6
  Top 0.254: R8.1 7.45,17.02 | 7.49,17.02 R8.1 | D3.A 3.97,11.3 3.97,13.24 7.75,17.02 R8.1
N$7
  Top 1.016: J2.P$7 24.26,2.51 R5.2
N$8
  Top 0.254: 9.14,17.02 R7.1 8.47,16.13 7.75,16.13 5.08,13.46 5.08,9.91 4.45,9.27 D4.A
N$9
  Top 0.254: 10.71,17.06 R6.1 9.61,15.62 8,15.62 5.59,13.21 5.59,8.13 4.7,7.24 D5.A
N$10
  Top 0.254: U3.9 15.62,54.61 15.37,54.86 15.44,54.86 U5.P$3
N$11
  Top 0.457: 17.09,58.6 17.09,58.34 15.44,56.69 15.44,56.16
N$12
  Top 0.254: U3.17 10.98,52.14 10.29,52.83 10.29,53.98 10.16,54.1 9.47,54.1 Y2.P$1 7.68,54.11 C18.1
N$13
  Top 0.254: 13.61,52.68 13.61,53.57
N$15
  Top 0.254: 11.56,46.13 10.87,46.13
N$17
  Top 0.254: 16.61,43.46 16.61,44.04
N$18
  Top 0.254: 17.12,44.04 17.14,44.04 17.14,43.59
N$19
  Top 0.254: 20.19,46.63 20.75,46.63
N$20
  Top 0.254: 20.22,46.13 20.73,46.13
N$24
  Top 0.254: U4.16 20.19,20.29 C14.1
PWM0
  Top 0.254: J4.5 29.59,25.78 23.88,31.5 23.88,40.39 22.48,41.78 21.46,41.78 20.7,42.55 20.7,44.14 U3.49
PWM1
  Top 0.254: U3.50 20.78,45.14 21.21,44.7 21.21,42.93 21.72,42.42 22.73,42.42 24.64,40.51 24.64,33.27 29.59,28.32 J4.6
PWM2
  Top 0.254: U3.51 21.04,45.64 21.72,44.96 21.72,43.18 21.97,42.93 23.11,42.93 25.15,40.89 25.15,35.31 29.59,30.86 J4.7
RESET
  Top 0.254: U3.12 14.12,53.82 11.43,56.52 4.57,56.52 3.05,54.99 1.52,54.99 1.14,54.61 1.14,21.84 2.41,20.57 2.41,20.7 J3.3 5.21,20.7 5.84,21.34 5.84,22.86 7.62,24.64 10.24,24.64 D2.3
  Top 0.508: U1.1 12.48,24.94 R3.1 11.42,24.13 11.17,24.37 10.51,24.37 10.24,24.64
RXD
  Top 0.254: U3.46 18.62,42.37 20.61,40.39 21.72,40.39 22.48,39.62 22.48,29.67 22.06,29.25 TP2.TP 22.06,25.92 17.22,21.08 17.22,16.82 17.73,16.31 U4.21
SCK
  Top 0.254: U3.37 14.12,41.18 13.21,40.26 12.32,40.26 11.94,39.88 11.94,38.23 12.32,37.85 U6.6 15.24,37.85 15.49,37.59 15.49,34.67 10.41,29.59 8.13,29.59 6.86,28.32 J3.6
SS
  Top 0.254: U3.36 13.62,41.44 12.95,40.77 9.78,40.77 8.38,39.37 8.38,32.38 6.86,30.86 J3.7
STATUS_LED_0  (via drill 0.33)
  Top 0.254: v5.33,32.13 5.33,34.42 6.86,35.94 6.86,41.66 10.84,45.64 U3.30 | v7.37,20.07 7.75,19.68 R8.2
  Bottom 0.254: v5.33,32.13 5.84,31.62 5.84,21.59 v7.37,20.07
STATUS_LED_1  (via drill 0.33)
  Top 0.254: v6.35,34.29 7.37,35.31 7.37,41.4 11.1,45.14 U3.31 | v9.14,20.07 9.14,19.01 arc90 R7.2
  Bottom 0.254: v6.35,34.29 6.35,22.1 7.49,20.95 8.26,20.95 v9.14,20.07
STATUS_LED_2  (via drill 0.33)
  Top 0.254: U3.32 11.49,44.64 11.49,44.58 11.3,44.58 7.87,41.15 7.87,33.15 v7.37,32.64 | v10.79,20.07 10.79,19.01 arc90 R6.2
  Bottom 0.254: v7.37,32.64 6.86,32.13 6.86,22.48 7.75,21.59 9.27,21.59 v10.79,20.07
TXD
  Top 0.254: U3.47 19.12,42.6 20.83,40.89 21.97,40.89 22.99,39.88 22.99,29.67 24.07,28.59 TP3.TP 24.07,27.17 17.68,20.78 17.68,17.04 17.91,16.82 U4.20
USB_5V  (via drill 0.33)
  Top 0.254: U4.8 23.57,15.29 v24,14.86 24,14.81 U4.7 | 14.73,18.67 D1.3
  Top 0.61: 14.82,18.8 D1.3 15.71,18.71 16.26,18.16 16.26,14.86 v17.02,14.1 17.02,12.96 F1.2 | 14.92,18.86 14.73,18.67 | 24,14.81 25.18,14.81 C13.1
  Bottom 0.254: v24,14.86 17.78,14.86 v17.02,14.1
USB_VDD  (via drill 0.33)
  Top 0.254: U4.6 23.43,14.07 C12.1 | U4.5 21.21,13.14 C11.1
  Top 0.406: C12.1 23.79,13.18 v22.91,13.18
  Top 0.61: R4.1 25.53,17.37 25.53,16.46 v25.15,16.08 | C11.1 22.21,13.18 v22.91,13.18
  Bottom 0.61: v22.91,13.18 22.99,13.72 24.38,13.72 25.15,14.48 v25.15,16.08
V_IN  (via drill 0.33)
  Top 0.254: R1.2 31.46,15.33 31.75,15.62 J4.1 | 10.29,12.7 10.16,12.7 9.14,12.7 v7.87,11.43
  Top 1.016: U2.3 18.26,24.52 C2.1 15.75,23.24 13.78,21.27 D1.2 12.72,19.85 C1.1
  Top 1.27: v6.86,1.65 6.86,10.49 9.02,12.65 J1.3 10.29,12.7 10.29,14.35 10.92,14.99 11.57,14.99 12.72,16.13 C1.1
  Bottom 1.016: v6.86,1.65 7.49,1.02 25.27,1.02 25.27,4.19 29.46,4.19 | 29.46,4.19 JP1.2 | J4.1 35.31,13.97 35.31,7.11 32.38,7.11 29.46,4.19
  Bottom 1.27: v7.87,11.43 9.14,12.7 10.29,12.7
VCC  (via drill 0.33)
  Top 0.254: U3.34 12.62,42.72 12.06,42.16 11.56,42.16 v11.3,41.91 | U3.44 17.62,43.38 v16.92,42.67 | U3.59 21.23,49.64 v21.34,49.53 | U3.54 20.93,47.14 21.34,46.74 21.34,46.35 v21.51,46.28 22.09,45.71 C6.1 | v10.41,49.02 10.53,49.14 U3.23
  Top 0.406: U6.7 12.83,36.58 11.44,36.58 C17.1 10.4,36.56 10.29,36.67 v10.29,39.88 | 12.7,35.31 U6.8 | C5.1 9.5,49.02 v10.41,49.02
  Top 0.508: J3.1 4.19,15.62 5.97,17.4 5.97,20.19 6.86,21.08 10.03,21.08 11.11,22.16 D2.2 11.32,22.61 13.08,22.61 14.1,23.62 14.1,24.04 R3.2 | R3.2 14.05,23.88 | v11.56,32 12.7,33.15 12.7,35.31 12.83,35.43 12.83,36.58 | C3.1 17.53,28.72 | R3.2 14.45,24.4 14.45,26.19 13.24,27.41 U1.2
  Top 0.61: 17.53,28.59 C3.1
  Top 1.016: U2.2 17.46,28.5 C3.1 17.41,28.83 14.73,28.83 v14.61,28.7 13.31,27.41 U1.2
  Bottom 0.254: 16.92,49.38 16.89,49.4
  Bottom 0.406: v10.41,49.02 11.3,49.02 11.68,49.4 16.89,49.4 | v10.29,39.88 10.29,40.89 v11.3,41.91 12.06,42.67 v16.92,42.67 16.92,49.38 17.14,49.66 21.08,49.66 v21.34,49.53 21.34,47.88 21.46,47.75 21.46,46.33 v21.51,46.28
  Bottom 1.016: v11.56,32 14.61,28.96 v14.61,28.7
VUSB
  Top 0.61: J2.P$1 17.75,5.39 17.75,9.98 | 17.75,9.98 17.75,10.23 F1.1 | D8.2 18.15,9.59 17.75,9.98
XTAL1
  Top 0.254: U3.57 21.72,48.64 21.97,48.39 23.63,48.39 24.47,49.23 Y1.P$3 25.16,49.44 C7.1 24.84,51
XTAL2
  Top 0.254: U3.56 21.46,48.14 21.84,47.75 24.26,47.75 24.64,48.13 26.16,48.13 26.96,47.33 Y1.P$1 27.04,46.96 C9.1

### Text on the board
Bottom: 4.9
tNames: U5 | Y2 | J2
tSilk: SN | 0 | 7 | 6 | 1 | 2 | ANALOG | 5 | 3 | 4 | 4 | 3 | 5 | 2 | 6 | DIGITAL | 1 | 7 | 0 | GND | GND | SS | PWM | 2 | SCK | 1 | MOSI | 0 | MISO | NC | RST | NC | G | GND | VIN | 3.3V | S | C | E | - | +
200bmp: /Users/jeremybillheimer/Desktop/JEREMY/sapphire/Hardware/mainboard_rev_4.6_B/artwork/top-2.bmp
201bmp: /Users/jeremybillheimer/Desktop/JEREMY/sapphire/Hardware/mainboard_rev_4.7/bottom-9.bmp